# Altium schematic sheet Audio_out.SchDoc
size A4
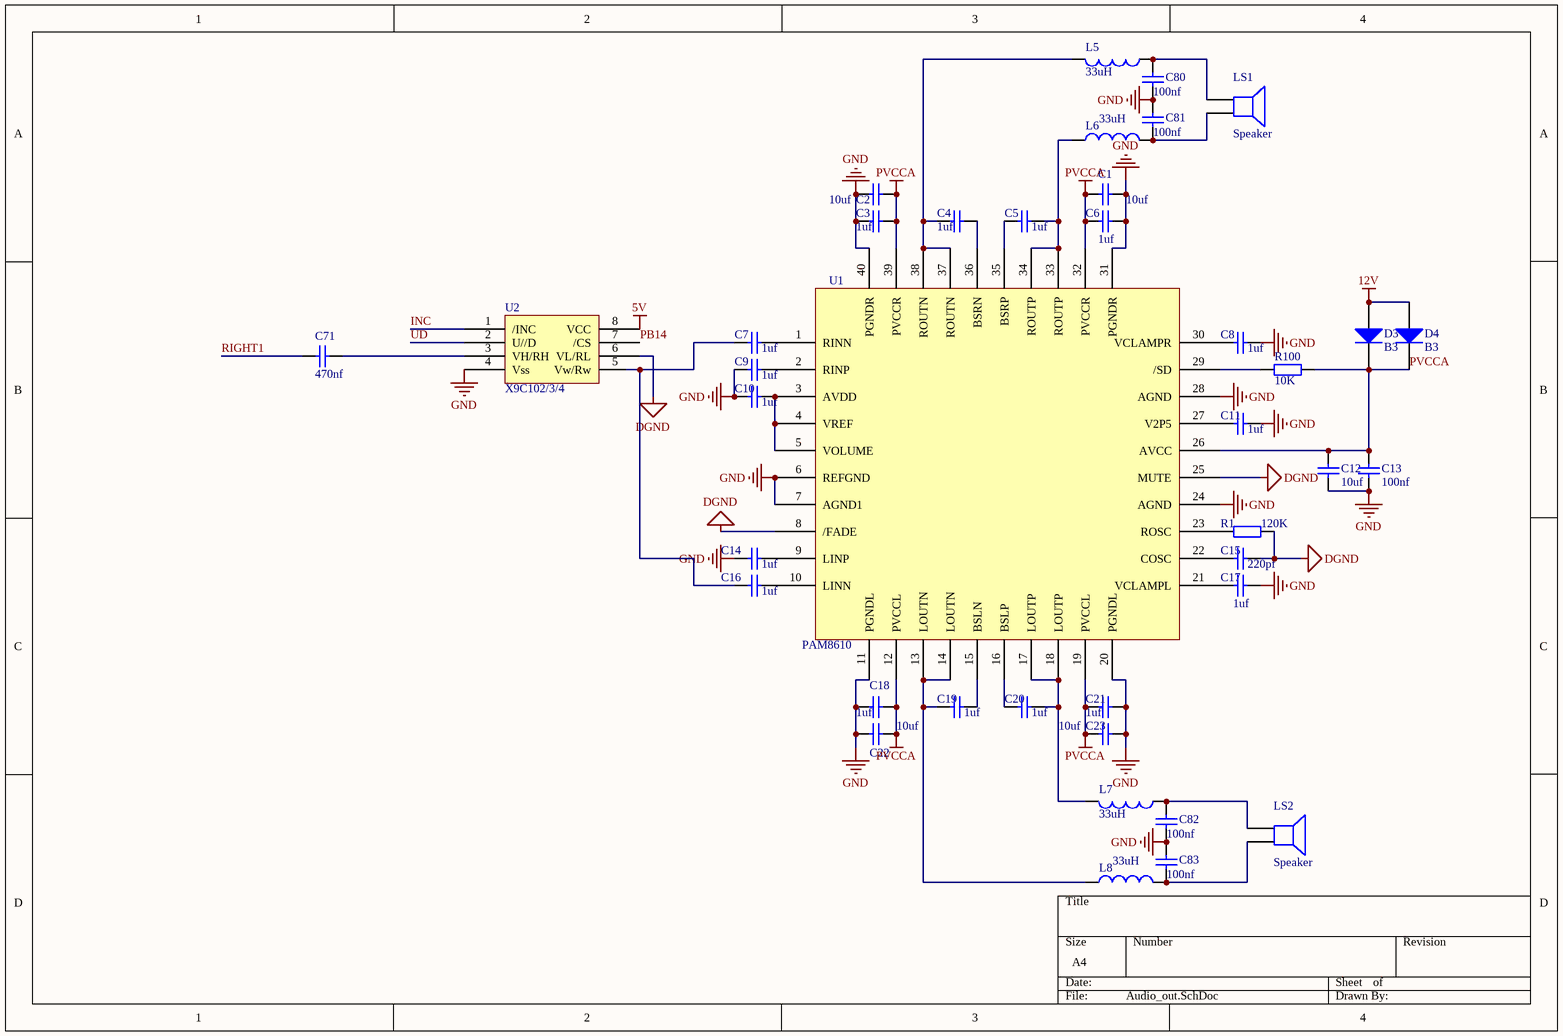
[diagram p0: Audio_out.SchDoc]

## Parts
C1  10uf  [0805C]
C2  10uf  [0805C]
C3  1uf  [0805C]
C4  1uf  [0805C]
C5  1uf  [0805C]
C6  1uf  [0805C]
C7  1uf  [0805C]
C8  1uf  [0805C]
C9  1uf  [0805C]
C10  1uf  [0805C]
C11  1uf  [0805C]
C12  10uf  [0805C]
C13  100nf  [0805C]
C14  1uf  [0805C]
C15  220pf  [0805C]
C16  1uf  [0805C]
C17  1uf  [0805C]
C18  1uf  [0805C]
C19  1uf  [0805C]
C20  1uf  [0805C]
C21  1uf  [0805C]
C22  10uf  [0805C]
C23  10uf  [0805C]
C71  470nf  [0805C]
C80  100nf  [0805C]
C81  100nf  [0805C]
C82  100nf  [0805C]
C83  100nf  [0805C]
D3  B3  [LL-34 - duplicate]
D4  B3  [LL-34 - duplicate]
L5  33uH  [L0805]
L6  33uH  [L0805]
L7  33uH  [L0805]
L8  33uH  [L0805]
LS1  Speaker  [PIN2]
LS2  Speaker  [PIN2]
R1  120K  [0805R]
R100  10K  [0805R]
U1  PAM8610  [QFN40-0.5]
U2  X9C102/3/4  [sop_8]

## Nets
5V: U2.8(VCC)
12V: D3.1(A) D4.1(A)
DGND: C15.1 R1.2 U1.8(/FADE) U1.25(MUTE) U2.6(VL/RL)
GND: C1.2 C2.1 C3.1 C6.2 C8.1 C9.2 C10.2 C11.1 C12.2 C13.2 C14.2 C17.2 C18.2 C21.1 C22.2 C23.1 C80.2 C81.1 C82.2 C83.1 U1.6(REFGND) U1.7(AGND1) U1.11(PGNDL) U1.20(PGNDL) U1.24(AGND) U1.28(AGND) U1.31(PGNDR) U1.40(PGNDR) U2.4(Vss)
PVCCA: C1.1 C2.2 C3.2 C6.1 C12.1 C13.1 C18.1 C21.2 C22.1 C23.2 D3.2(K) D4.2(K) R100.1 U1.12(PVCCL) U1.19(PVCCL) U1.26(AVCC) U1.32(PVCCR) U1.39(PVCCR)
INC: U2.1(/INC)
PB14: U2.7(/CS)
RIGHT1: C71.2
UD: U2.2(U//D)
NetC4_1: C4.1 U1.36(BSRN)
NetC4_2: C4.2 L5.2 U1.37(ROUTN) U1.38(ROUTN)
NetC5_1: C5.1 L6.1 U1.33(ROUTP) U1.34(ROUTP)
NetC5_2: C5.2 U1.35(BSRP)
NetC7_1: C7.1 U1.1(RINN)
NetC7_2: C7.2 C16.2 U2.5(Vw/Rw)
NetC8_2: C8.2 U1.30(VCLAMPR)
NetC9_1: C9.1 U1.2(RINP)
NetC10_1: C10.1 U1.3(AVDD) U1.4(VREF) U1.5(VOLUME)
NetC11_2: C11.2 U1.27(V2P5)
NetC14_1: C14.1 U1.9(LINP)
NetC15_2: C15.2 U1.22(COSC)
NetC16_1: C16.1 U1.10(LINN)
NetC17_1: C17.1 U1.21(VCLAMPL)
NetC19_1: C19.1 U1.15(BSLN)
NetC19_2: C19.2 L8.1 U1.13(LOUTN) U1.14(LOUTN)
NetC20_1: C20.1 L7.2 U1.17(LOUTP) U1.18(LOUTP)
NetC20_2: C20.2 U1.16(BSLP)
NetC71_1: C71.1 U2.3(VH/RH)
NetC80_1: C80.1 L5.1 LS1.1
NetC81_2: C81.2 L6.2 LS1.2
NetC82_1: C82.1 L7.1 LS2.1
NetC83_2: C83.2 L8.2 LS2.2
NetR1_1: R1.1 U1.23(ROSC)
NetR100_2: R100.2 U1.29(/SD)

## Library data of the parts
C1-C23 C71 C80-C83 = Cap: Capacitor; Value: 0.1uF; Published: 8-Jun-2000; LatestRevisionDate: 17-Jul-2002; LatestRevisionNote: Re-released for DXP Platform.; PackageReference: RAD-0.3; Publisher: Altium Limited; PackageDescription: Radial Cap, Thru-Hole; 2 Leads; 0.3 in Pin Spacing
D3 D4 = Diode 1N4148: High Conductance Fast Diode; Published: 8-Jun-2000; LatestRevisionDate: 17-Jul-2002; LatestRevisionNote: Re-released for DXP Platform.; DatasheetVersion: 1997; PackageReference: DO-35; Publisher: Altium Limited; PackageDescription: Diode, Axial; Body 3.8 x 1.9 mm (LxDia. max), Lead Dia. 0.53 mm (max); Code_JEDEC: DO-204-AH; ComponentLink1Description: Manufacturer Link; ComponentLink1URL: http://www.fairchildsemi.com/; ComponentLink2Description: Datasheet; ComponentLink2URL: http://www.fairchildsemi.com/ds/1N%2F1N4148.pdf
L5-L8 = Inductor: Code_IEC: 1005; Published: 8-Jun-2000; LatestRevisionDate: 29-May-2009; LatestRevisionNote: IPC-7351 Footprint Added.; PackageReference: 0402-A; Publisher: Altium Limited; PackageDescription: Chip Inductor; Code_JEITA: 0402
LS1 LS2 = Speaker: Loudspeaker; Published: 24-Mar-1999; LatestRevisionDate: 17-Jul-2002; LatestRevisionNote: Re-released for DXP Platform.; PackageReference: PIN2; Publisher: Altium Limited
R1 = Res2: Resistor; Value: 10K; Published: 8-Jun-2000; LatestRevisionDate: 17-Jul-2002; LatestRevisionNote: Re-released for DXP Platform.; PackageReference: AXIAL-0.4; Publisher: Altium Limited; PackageDescription: Axial Device, Thru-Hole; 2 Leads; 0.4 in Pin Spacing
R100 = Res2: Resistor; Published: 8-Jun-2000; LatestRevisionDate: 17-Jul-2002; LatestRevisionNote: Re-released for DXP Platform.; PackageReference: AXIAL-0.4; Publisher: Altium Limited; PackageDescription: Axial Device, Thru-Hole; 2 Leads; 0.4 in Pin Spacing; Value: 10K